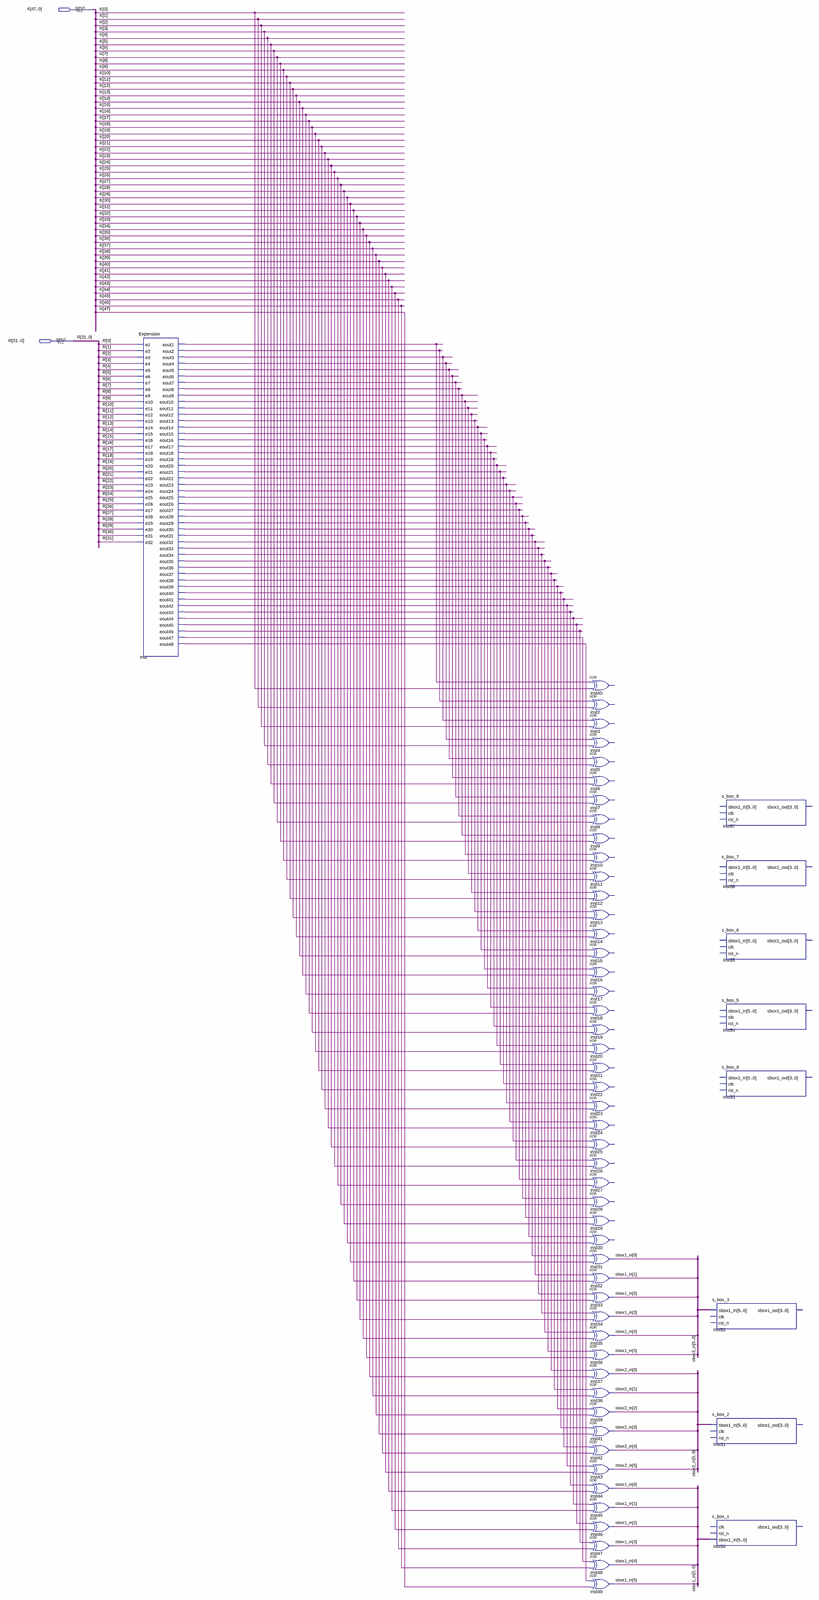
[diagram p0: schematic sheet, whole]
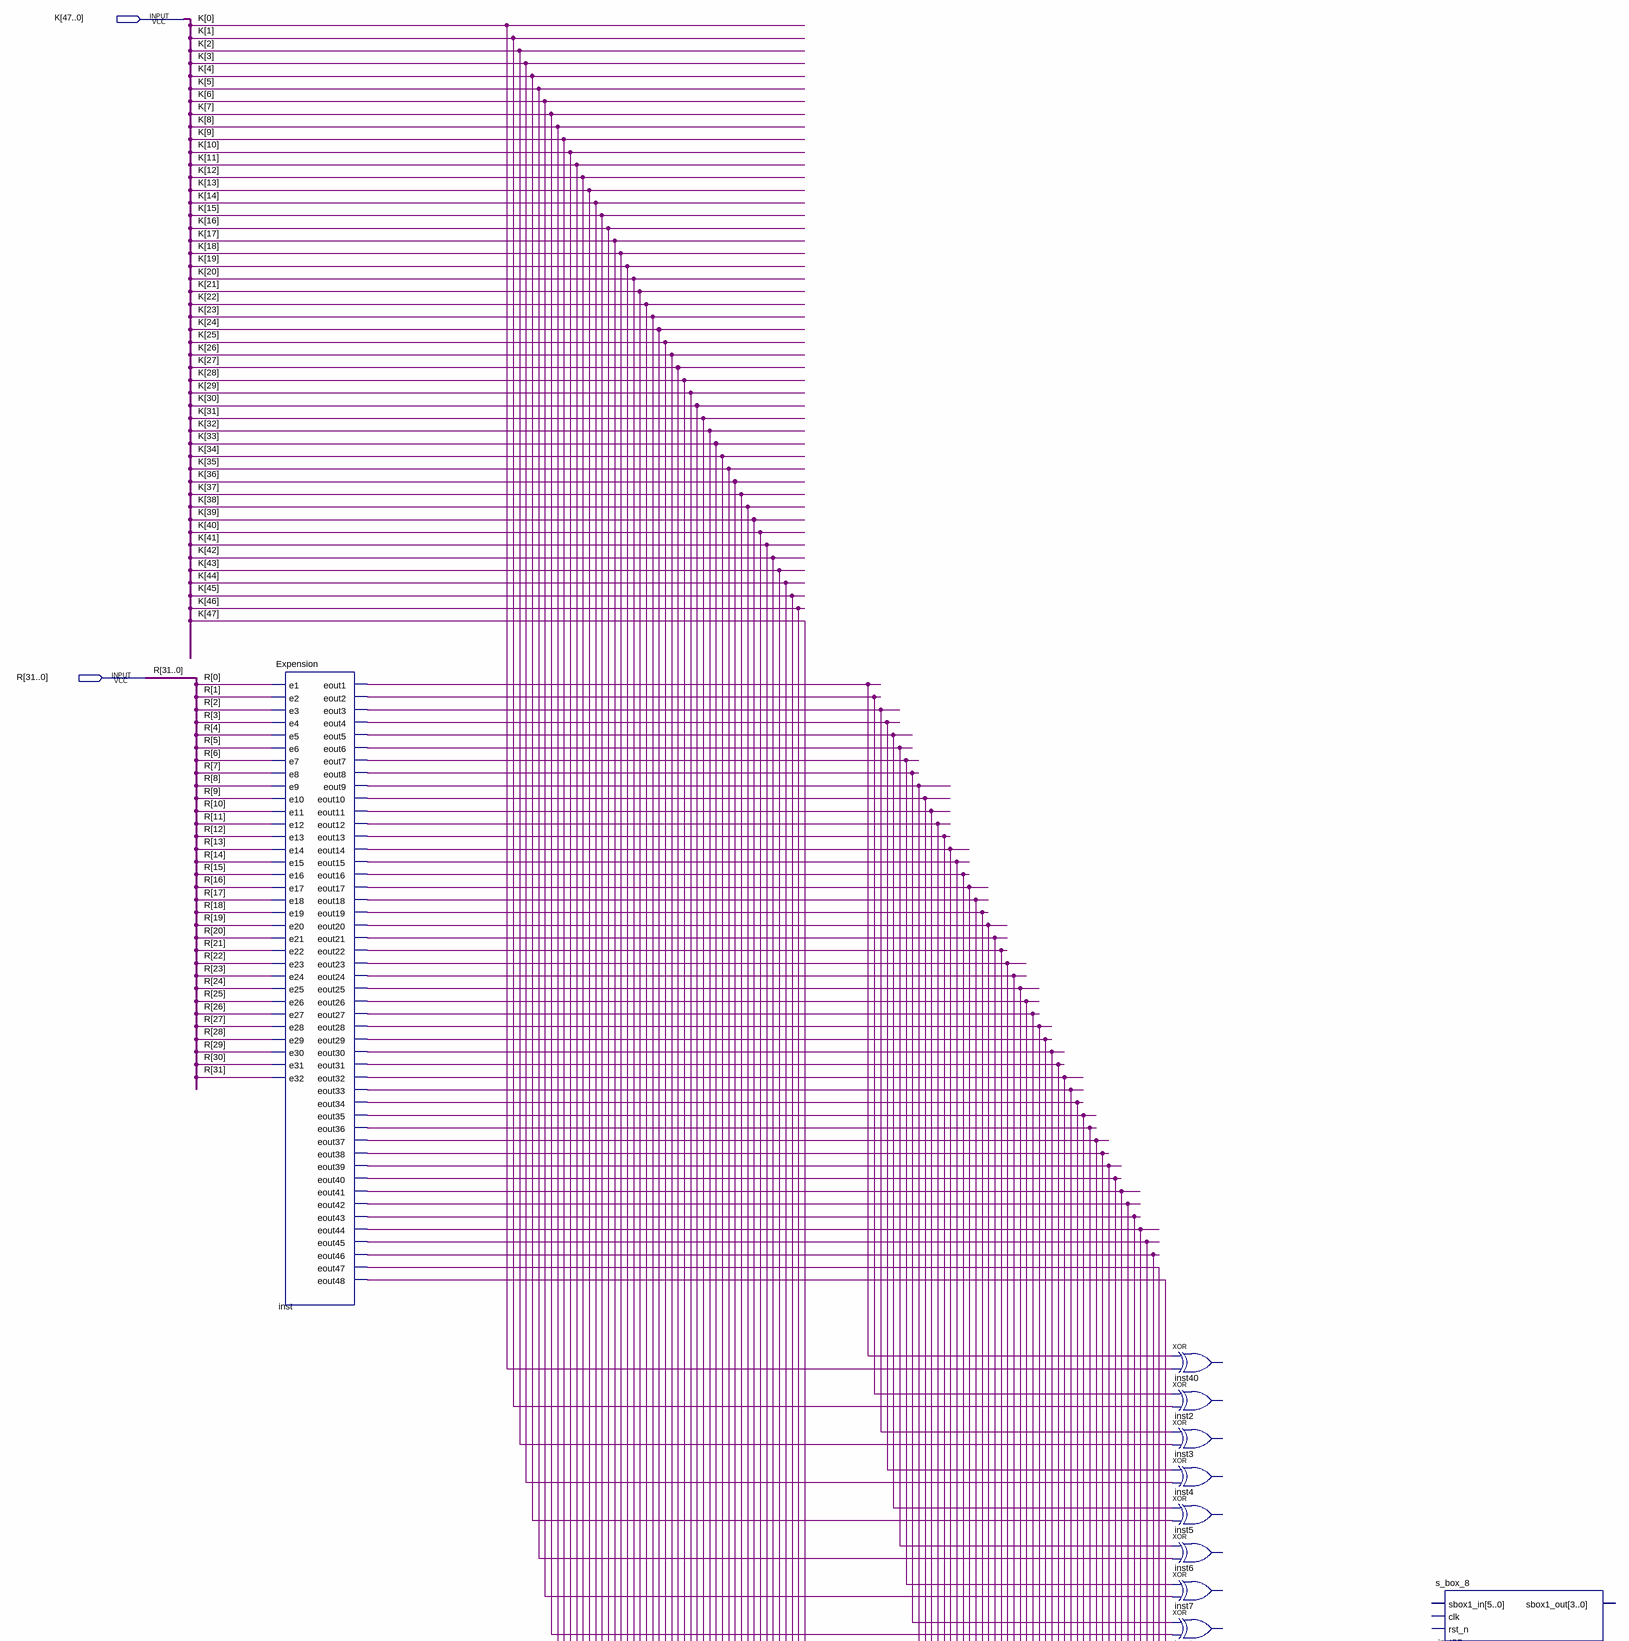
[diagram p1: schematic sheet, upper part]
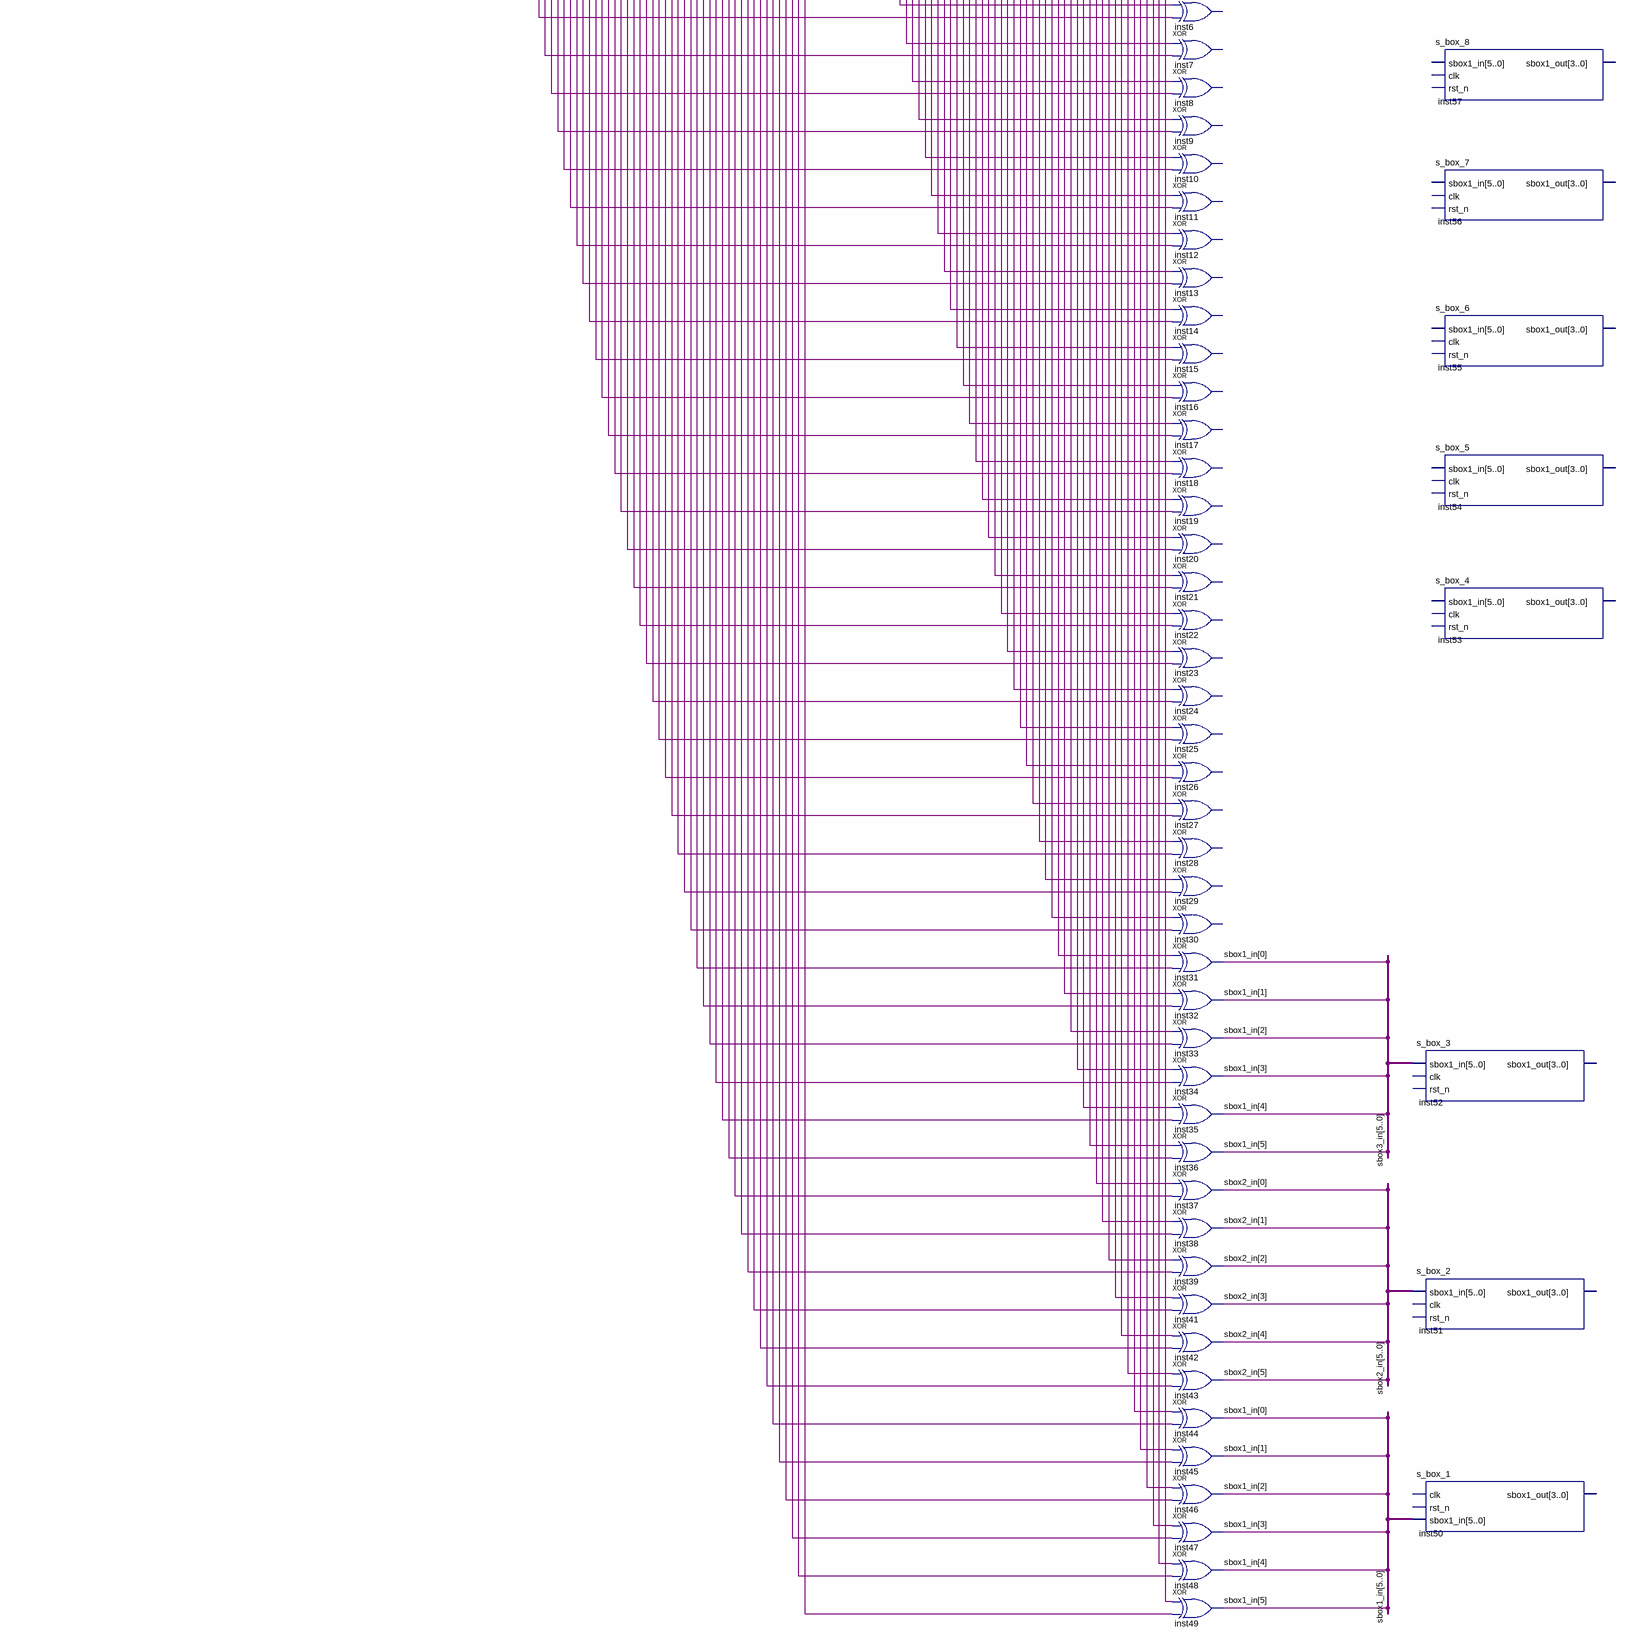
[diagram p2: schematic sheet, lower part]
// Quartus schematic f_bac.bdf as structural Verilog: 57 symbols, 2 pins
module f_bac (
  input  [47:0] K,
  input  [31:0] R
);

  wire inst_eout1, inst_eout2, inst_eout3, inst_eout4, inst_eout5, inst_eout6, inst_eout7, inst_eout8,
       inst_eout9, inst_eout10, inst_eout11, inst_eout12, inst_eout13, inst_eout14, inst_eout15, inst_eout16,
       inst_eout17, inst_eout18, inst_eout19, inst_eout20, inst_eout21, inst_eout22, inst_eout23,
       inst_eout24, inst_eout25, inst_eout26, inst_eout27, inst_eout28, inst_eout29, inst_eout30,
       inst_eout31, inst_eout32, inst_eout33, inst_eout34, inst_eout35, inst_eout36, inst_eout37,
       inst_eout38, inst_eout39, inst_eout40, inst_eout41, inst_eout42, inst_eout43, inst_eout44,
       inst_eout45, inst_eout46, inst_eout47, inst_eout48;
  wire [5:0] sbox1_in, sbox2_in, sbox3_in;

  Expension inst (
    .e1(R[0]), .e2(R[1]), .e3(R[2]), .e4(R[3]), .e5(R[4]), .e6(R[5]), .e7(R[6]), .e8(R[7]), .e9(R[8]),
    .e10(R[9]), .e11(R[10]), .e12(R[11]), .e13(R[12]), .e14(R[13]), .e15(R[14]), .e16(R[15]), .e17(R[16]),
    .e18(R[17]), .e19(R[18]), .e20(R[19]), .e21(R[20]), .e22(R[21]), .e23(R[22]), .e24(R[23]), .e25(R[24]),
    .e26(R[25]), .e27(R[26]), .e28(R[27]), .e29(R[28]), .e30(R[29]), .e31(R[30]), .e32(R[31]),
    .eout1(inst_eout1), .eout2(inst_eout2), .eout3(inst_eout3), .eout4(inst_eout4), .eout5(inst_eout5),
    .eout6(inst_eout6), .eout7(inst_eout7), .eout8(inst_eout8), .eout9(inst_eout9), .eout10(inst_eout10),
    .eout11(inst_eout11), .eout12(inst_eout12), .eout13(inst_eout13), .eout14(inst_eout14),
    .eout15(inst_eout15), .eout16(inst_eout16), .eout17(inst_eout17), .eout18(inst_eout18),
    .eout19(inst_eout19), .eout20(inst_eout20), .eout21(inst_eout21), .eout22(inst_eout22),
    .eout23(inst_eout23), .eout24(inst_eout24), .eout25(inst_eout25), .eout26(inst_eout26),
    .eout27(inst_eout27), .eout28(inst_eout28), .eout29(inst_eout29), .eout30(inst_eout30),
    .eout31(inst_eout31), .eout32(inst_eout32), .eout33(inst_eout33), .eout34(inst_eout34),
    .eout35(inst_eout35), .eout36(inst_eout36), .eout37(inst_eout37), .eout38(inst_eout38),
    .eout39(inst_eout39), .eout40(inst_eout40), .eout41(inst_eout41), .eout42(inst_eout42),
    .eout43(inst_eout43), .eout44(inst_eout44), .eout45(inst_eout45), .eout46(inst_eout46),
    .eout47(inst_eout47), .eout48(inst_eout48));
  // XOR inst40 has open pins: IN1=inst_eout1, IN2=K[0], OUT=open
  // XOR inst2 has open pins: IN1=inst_eout2, IN2=K[1], OUT=open
  // XOR inst3 has open pins: IN1=inst_eout3, IN2=K[2], OUT=open
  // XOR inst4 has open pins: IN1=inst_eout4, IN2=K[3], OUT=open
  // XOR inst5 has open pins: IN1=inst_eout5, IN2=K[4], OUT=open
  // XOR inst6 has open pins: IN1=inst_eout6, IN2=K[5], OUT=open
  // XOR inst7 has open pins: IN1=inst_eout7, IN2=K[6], OUT=open
  // XOR inst8 has open pins: IN1=inst_eout8, IN2=K[7], OUT=open
  // XOR inst9 has open pins: IN1=inst_eout9, IN2=K[8], OUT=open
  // XOR inst10 has open pins: IN1=inst_eout10, IN2=K[9], OUT=open
  // XOR inst11 has open pins: IN1=inst_eout11, IN2=K[10], OUT=open
  // XOR inst12 has open pins: IN1=inst_eout12, IN2=K[11], OUT=open
  // XOR inst13 has open pins: IN1=inst_eout13, IN2=K[12], OUT=open
  // XOR inst14 has open pins: IN1=inst_eout14, IN2=K[13], OUT=open
  // XOR inst15 has open pins: IN1=inst_eout15, IN2=K[14], OUT=open
  // XOR inst16 has open pins: IN1=inst_eout16, IN2=K[15], OUT=open
  // XOR inst17 has open pins: IN1=inst_eout17, IN2=K[16], OUT=open
  // XOR inst18 has open pins: IN1=inst_eout18, IN2=K[17], OUT=open
  // XOR inst19 has open pins: IN1=inst_eout19, IN2=K[18], OUT=open
  // XOR inst20 has open pins: IN1=inst_eout20, IN2=K[19], OUT=open
  // XOR inst21 has open pins: IN1=inst_eout21, IN2=K[20], OUT=open
  // XOR inst22 has open pins: IN1=inst_eout22, IN2=K[21], OUT=open
  // XOR inst23 has open pins: IN1=inst_eout23, IN2=K[22], OUT=open
  // XOR inst24 has open pins: IN1=inst_eout24, IN2=K[23], OUT=open
  // XOR inst25 has open pins: IN1=inst_eout25, IN2=K[24], OUT=open
  // XOR inst26 has open pins: IN1=inst_eout26, IN2=K[25], OUT=open
  // XOR inst27 has open pins: IN1=inst_eout27, IN2=K[26], OUT=open
  // XOR inst28 has open pins: IN1=inst_eout28, IN2=K[27], OUT=open
  // XOR inst29 has open pins: IN1=inst_eout29, IN2=K[28], OUT=open
  // XOR inst30 has open pins: IN1=inst_eout30, IN2=K[29], OUT=open
  xor inst31 (sbox1_in[0], inst_eout31, K[30]);
  xor inst32 (sbox1_in[1], inst_eout32, K[31]);
  xor inst33 (sbox1_in[2], inst_eout33, K[32]);
  xor inst34 (sbox1_in[3], inst_eout34, K[33]);
  xor inst35 (sbox1_in[4], inst_eout35, K[34]);
  xor inst36 (sbox1_in[5], inst_eout36, K[35]);
  xor inst37 (sbox2_in[0], inst_eout37, K[36]);
  xor inst38 (sbox2_in[1], inst_eout38, K[37]);
  xor inst39 (sbox2_in[2], inst_eout39, K[38]);
  xor inst41 (sbox2_in[3], inst_eout40, K[39]);
  xor inst42 (sbox2_in[4], inst_eout41, K[40]);
  xor inst43 (sbox2_in[5], inst_eout42, K[41]);
  xor inst44 (sbox1_in[0], inst_eout43, K[42]);
  xor inst45 (sbox1_in[1], inst_eout44, K[43]);
  xor inst46 (sbox1_in[2], inst_eout45, K[44]);
  xor inst47 (sbox1_in[3], inst_eout46, K[45]);
  xor inst48 (sbox1_in[4], inst_eout47, K[46]);
  xor inst49 (sbox1_in[5], inst_eout48, K[47]);
  s_box_8 inst57 ();  // open: sbox1_in, clk, rst_n, sbox1_out
  s_box_7 inst56 ();  // open: sbox1_in, clk, rst_n, sbox1_out
  s_box_6 inst55 ();  // open: sbox1_in, clk, rst_n, sbox1_out
  s_box_5 inst54 ();  // open: sbox1_in, clk, rst_n, sbox1_out
  s_box_4 inst53 ();  // open: sbox1_in, clk, rst_n, sbox1_out
  s_box_3 inst52 (.sbox1_in(sbox3_in));  // open: clk, rst_n, sbox1_out
  s_box_2 inst51 (.sbox1_in(sbox2_in));  // open: clk, rst_n, sbox1_out
  s_box_1 inst50 (.sbox1_in(sbox1_in));  // open: clk, rst_n, sbox1_out
endmodule
